# Altium schematic sheet 10_TYPE_C.SchDoc: C200
size 594 x 420 mm; Page Create Date: March  8, 1995; Page Number: 10; Page Size: A2; Comment: radxa_1010; Page Count: 21; RevCode: V1.11; Doc: 10_TYPE_C; DsnPath: D:\WMS\C200\CC122\对外\C200 V1.11.DSN; SchematicName: c200; PageName: 10_TYPE_C; PageSize: A2; TopSchematic: True
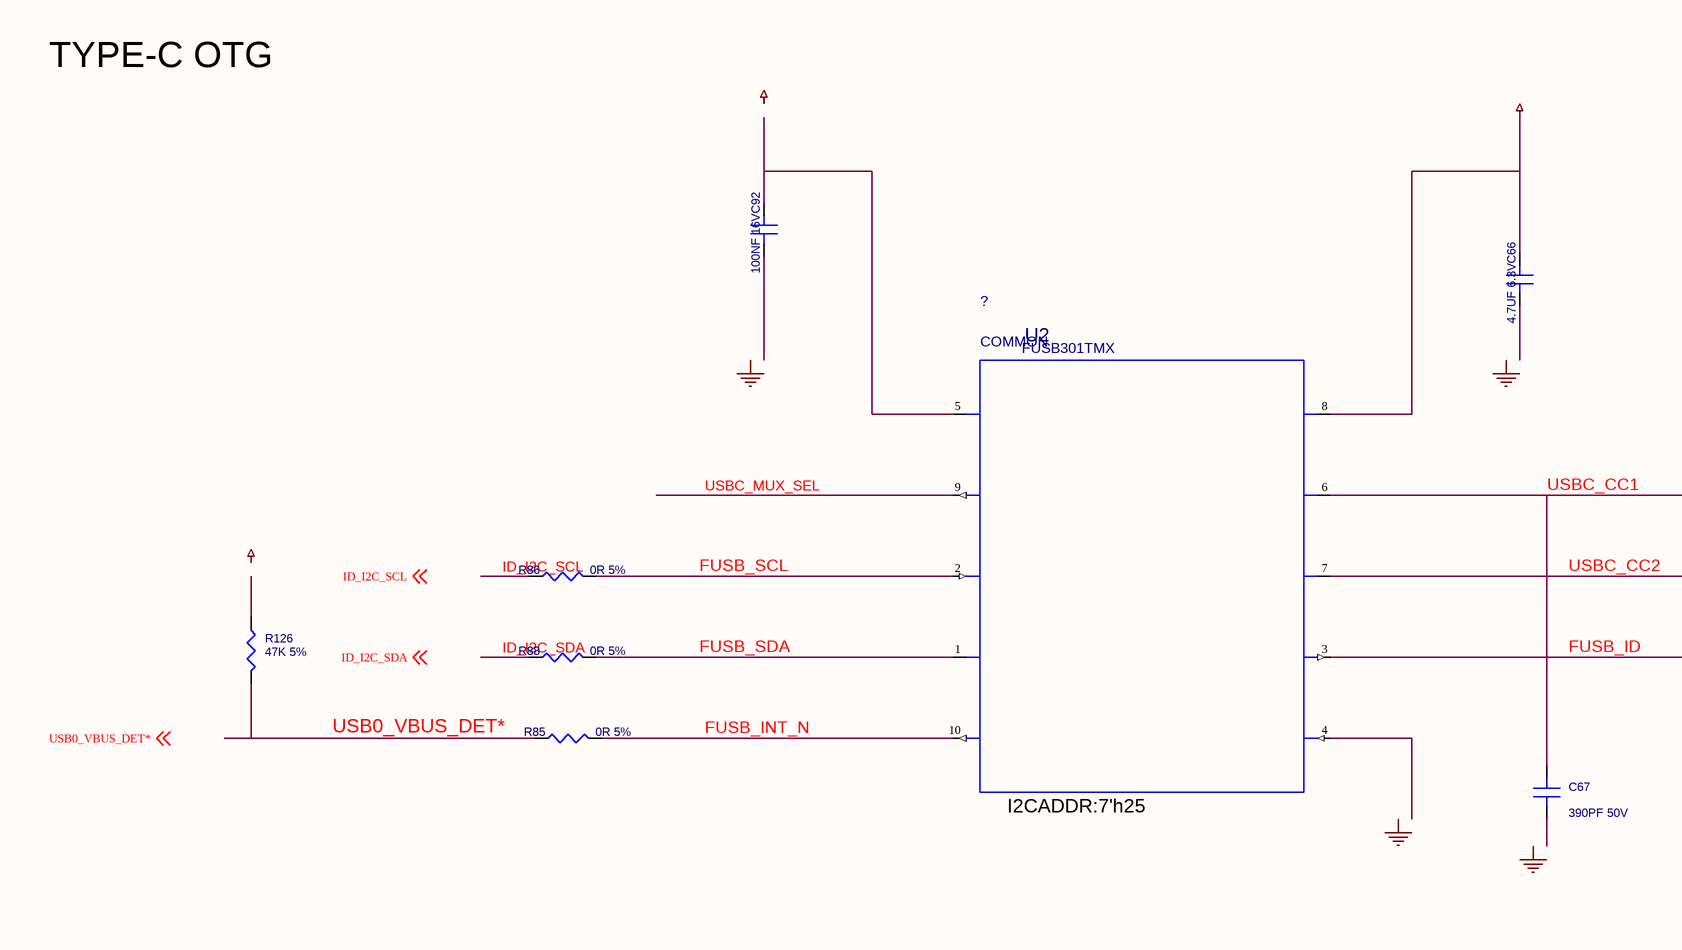
[diagram p0: 10_TYPE_C.SchDoc, top left]
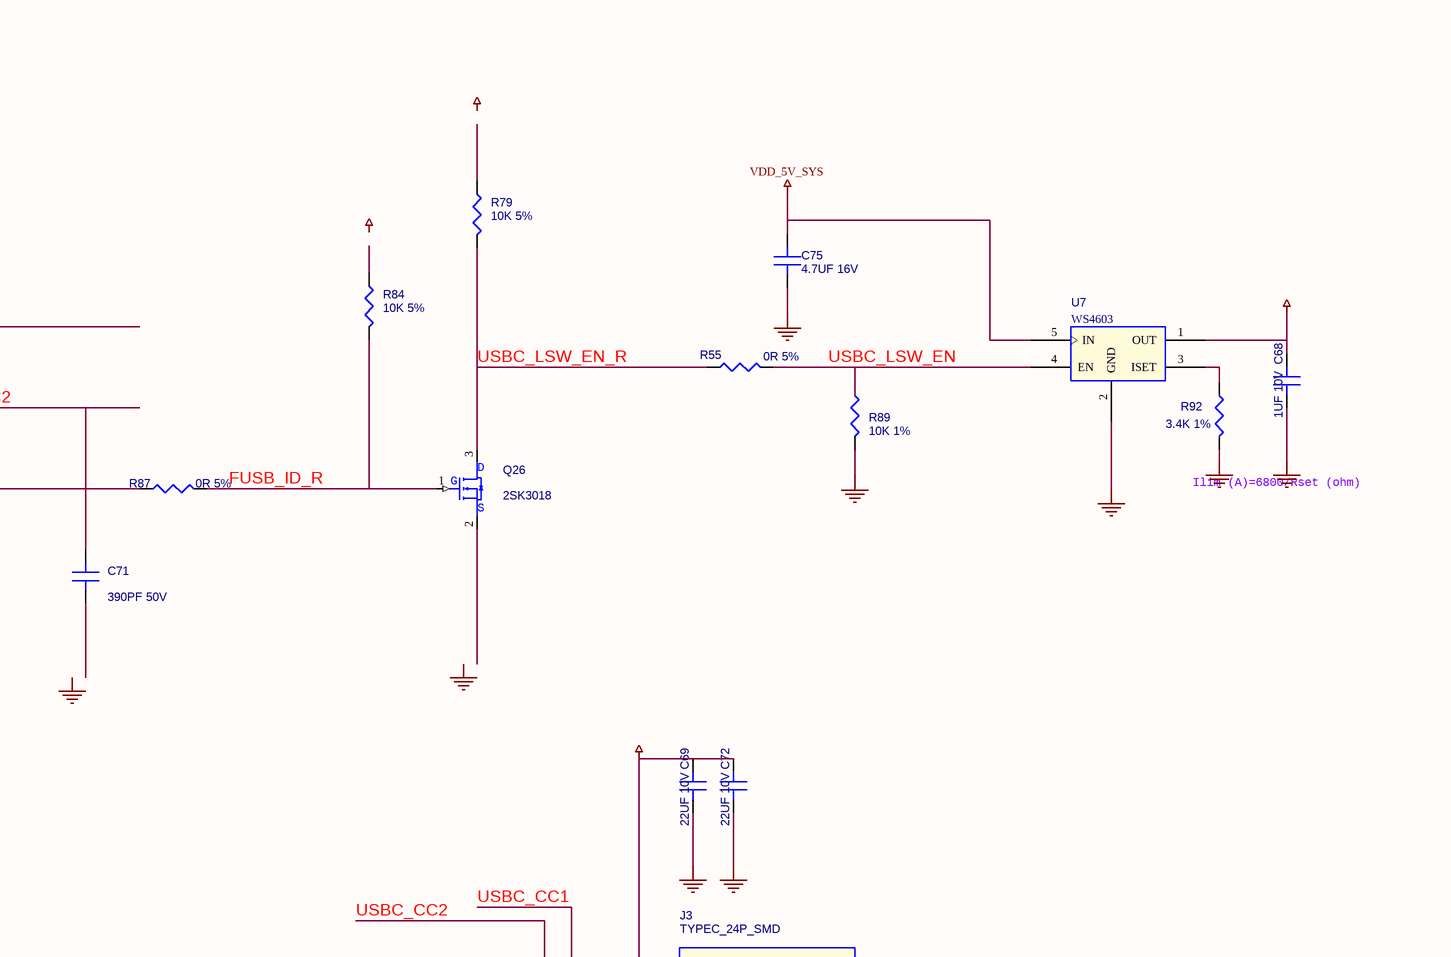
[diagram p1: 10_TYPE_C.SchDoc, top right]
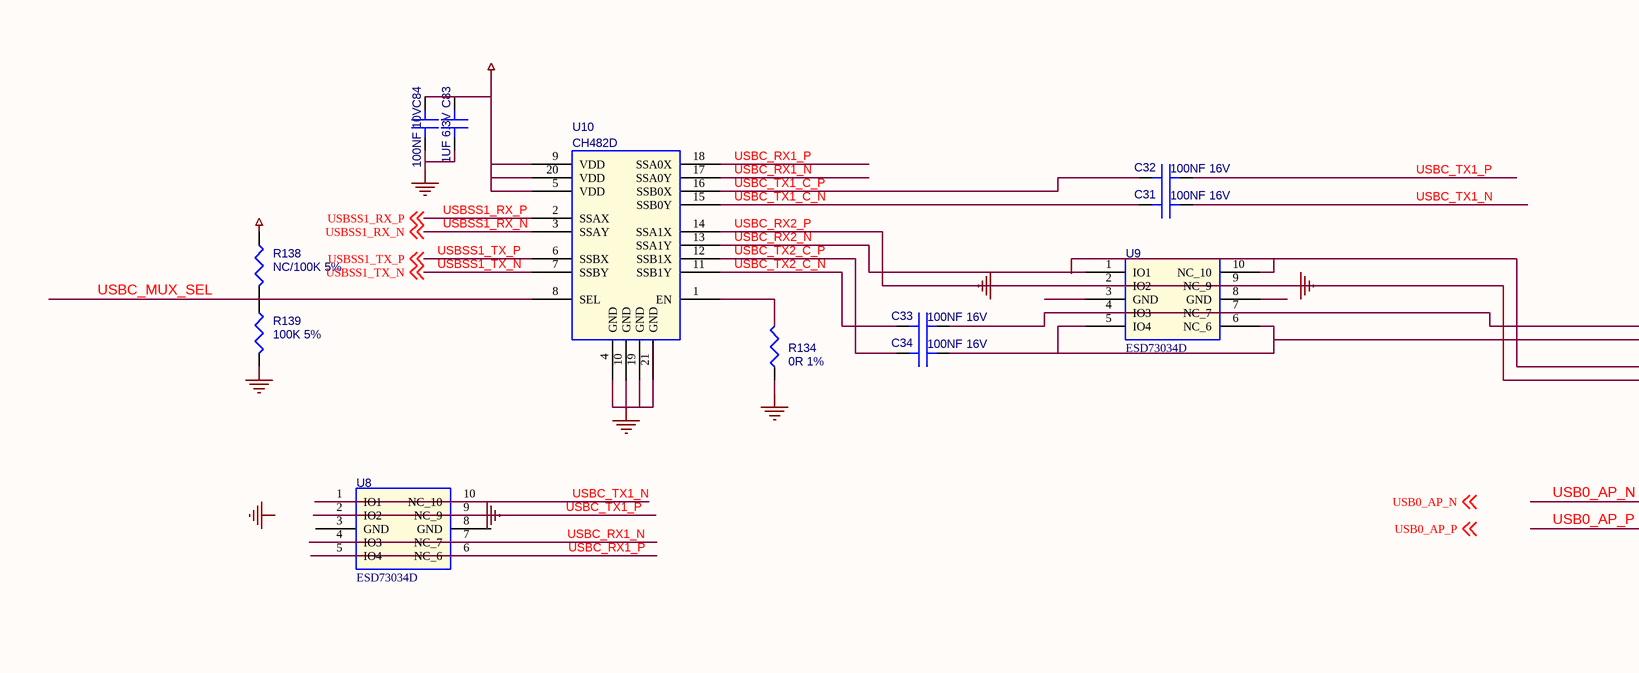
[diagram p2: 10_TYPE_C.SchDoc, bottom left]
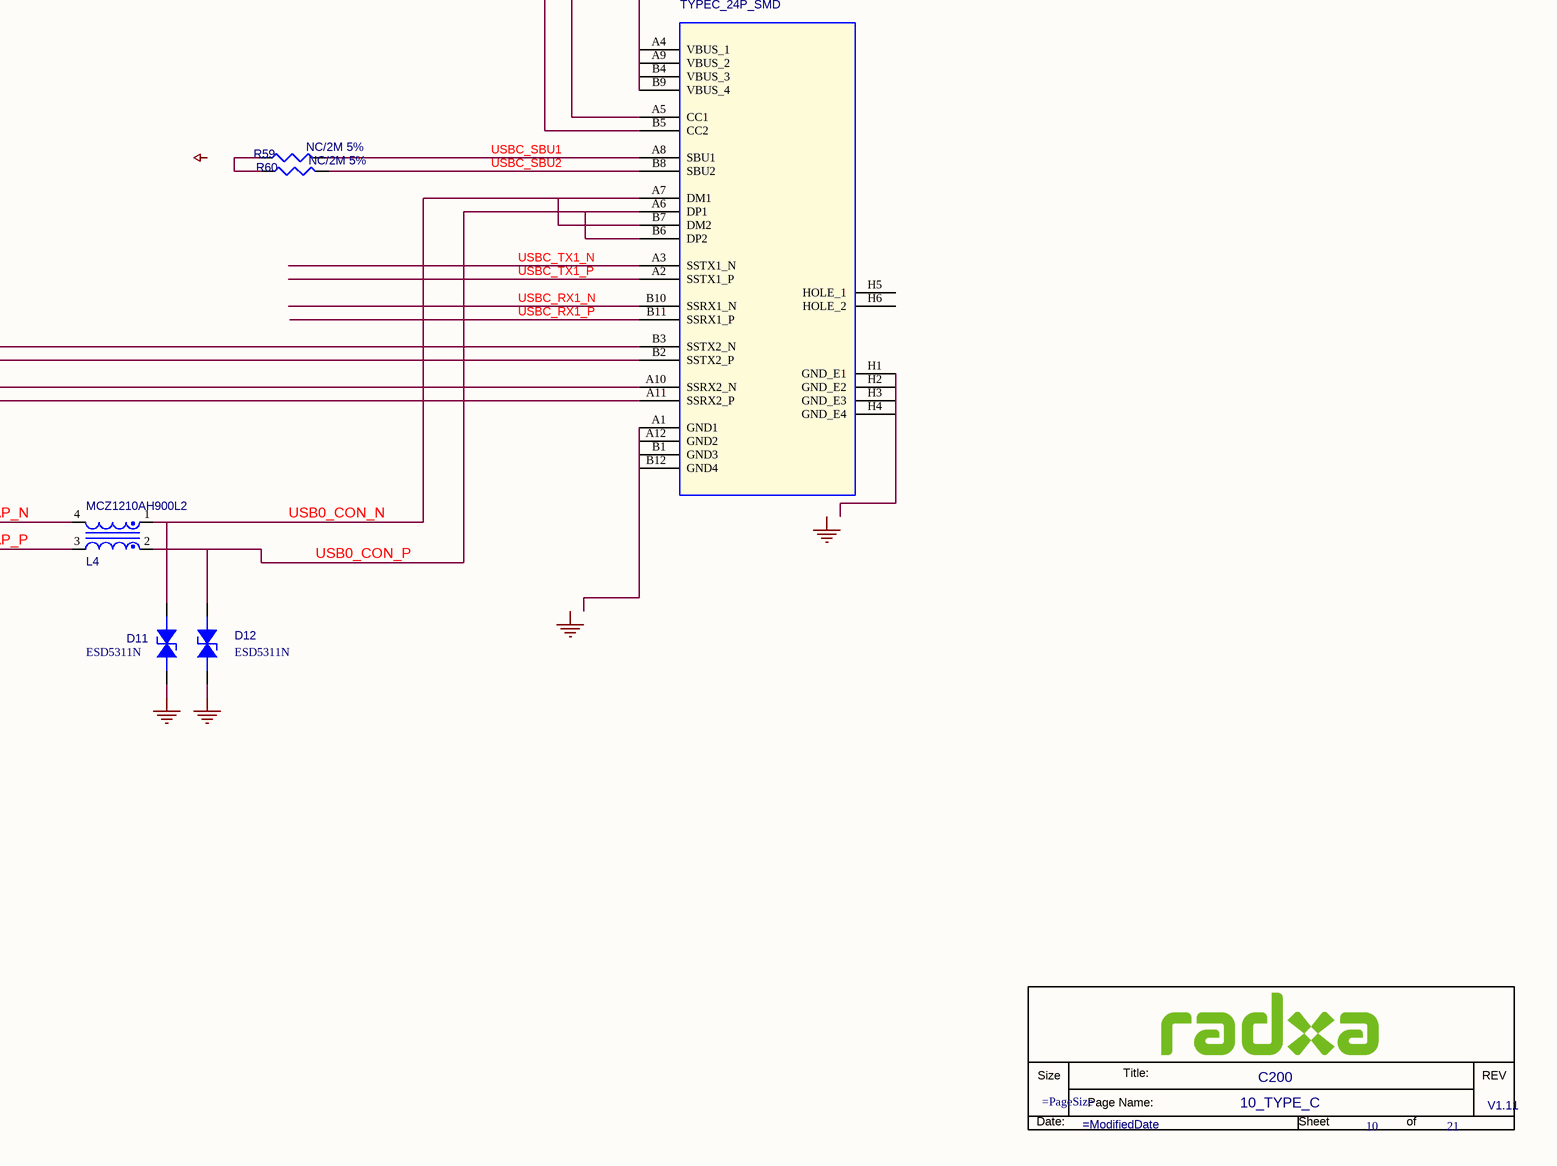
[diagram p3: 10_TYPE_C.SchDoc, bottom right]

## Parts
*  Doc: 10_TYPE_C  RevCode: V1.11  Title: C200  Page Number: 10  Page Count: 21  (hidden comment: radxa_1010)  (graphical)
C31  100NF 16V  [C0201]
C32  100NF 16V  [C0201]
C33  100NF 16V  [C0201]
C34  100NF 16V  [C0201]
C66  4.7UF 6.3V  [C0402]
C67  390PF 50V  [C0201]
C68  1UF 10V  [C0402]
C69  22UF 10V  [C0603]
C71  390PF 50V  [C0201]
C72  22UF 10V  [C0603]
C75  4.7UF 16V  [C0603]
C83  1UF 6.3V  [C0201]
C84  100NF 10V  [C0201]
C92  100NF 16V  [C0201]
D11  ESD5311N  [DFN1006-2L]
D12  ESD5311N  [DFN1006-2L]
J3  TYPEC_24P_SMD  [TYPEC_SM24_0D5_LIE]
L4  MCZ1210AH900L2  [LC1210]
Q26  2SK3018  [SOT_323]
R55  0R 5%  [R0402]
R59  NC/2M 5%  [R0402]
R60  NC/2M 5%  [R0402]
R79  10K 5%  [R0402]
R84  10K 5%  [R0402]
R85  0R 5%  [R0402]
R86  0R 5%  [R0402]
R87  0R 5%  [R0402]
R88  0R 5%  [R0402]
R89  10K 1%  [R0402]
R92  3.4K 1%  [R0402]
R126  47K 5%  [R0402]
R134  0R 1%  [R0402]
R138  NC/100K 5%  [R0402]
R139  100K 5%  [R0402]
U2  SKU: COMMON  [TMLP_0D4_1D2]  (hidden comment: U_USB_FUSB301)
U7  WS4603  [SOT23_5]
U8  ESD73034D  [XSON10_0D5_1D1X2D6]
U9  ESD73034D  [XSON10_0D5_1D1X2D6]
U10  CH482D  [QFN20_0D5_2D5]

## Nets
USBC_RX2_P: C32.2(B) C68.2(B) C69.2(B) C72.2(B) C75.2(B) C83.2(B) C84.2(B) D11.1(ANODE) D12.1(ANODE) J3.A2(SSTX1_P) J3.A11(SSRX2_P) R89.2 R92.1 R134.1 R139.2 U7.2(GND) U8.2(IO2) U8.9(NC_9) U9.2(IO2) U9.9(NC_9) U10.4(GND) U10.10(GND) U10.14(SSA1X) U10.19(GND) U10.21(GND)  [also labelled GND, USBC_TX1_P]
USBC_VBUS: C66.1(A) C68.1(A) C69.1(A) C72.1(A) J3.A4(VBUS_1) J3.A9(VBUS_2) J3.B4(VBUS_3) J3.B9(VBUS_4) U2.8(VBUS) U7.1(OUT)
VDD_3V3_SYS: C83.1(A) C84.1(A) R138.1 U10.5(VDD) U10.9(VDD) U10.20(VDD)
VDD_5V_SYS: C75.1(A) U7.5(IN)
FUSB_ID: R87.1 U2.3(ID)
FUSB_ID_R: Q26.1(G) R84.2 R87.2
FUSB_INT_N: R85.2 U2.10(INT_N)
FUSB_SCL: R86.2 U2.2(SCL)
FUSB_SDA: R88.2 U2.1(SDA)
ID_I2C_SCL: R86.1 ; off-sheet ID_I2C_SCL
ID_I2C_SDA: R88.1 ; off-sheet ID_I2C_SDA
USB0_AP_N: L4.4 ; off-sheet USB0_AP_N
USB0_AP_P: L4.3 ; off-sheet USB0_AP_P
USB0_CON_N: D11.2(CATHODE) J3.A7(DM1) J3.B7(DM2) L4.1
USB0_CON_P: D12.2(CATHODE) J3.A6(DP1) J3.B6(DP2) L4.2
USB0_VBUS_DET*: R85.1 R126.2 ; off-sheet USB0_VBUS_DET*
USBC_CC1: C67.1(A) J3.A5(CC1) U2.6(CC1)
USBC_CC2: C71.1(A) J3.B5(CC2) U2.7(CC2)
USBC_LSW_EN: R55.2 R89.1 U7.4(EN)
USBC_LSW_EN_R: Q26.3(D) R55.1 R79.2
USBC_MUX_SEL: R138.2 R139.1 U2.9(SS_SW) U10.8(SEL)
USBC_RX1_N: J3.B10(SSRX1_N) U8.4(IO3) U8.7(NC_7) U10.17(SSA0Y)
USBC_RX1_P: J3.B11(SSRX1_P) U8.5(IO4) U8.6(NC_6) U10.18(SSA0X)
USBC_RX2_N: J3.A10(SSRX2_N) U9.1(IO1) U9.10(NC_10) U10.13(SSA1Y)
USBC_SBU1: J3.A8(SBU1) R59.2
USBC_SBU2: J3.B8(SBU2) R60.2
USBC_TX1_C_N: C31.1(A) U10.15(SSB0Y)
USBC_TX1_C_P: C32.1(A) U10.16(SSB0X)
USBC_TX1_N: C31.2(B) J3.A3(SSTX1_N) U8.1(IO1) U8.10(NC_10)
USBC_TX2_C_N: C33.1(A) U10.11(SSB1Y)
USBC_TX2_C_P: C34.1(A) U10.12(SSB1X)
USBSS1_RX_N: U10.3(SSAY) ; off-sheet USBSS1_RX_N
USBSS1_RX_P: U10.2(SSAX) ; off-sheet USBSS1_RX_P
USBSS1_TX_N: U10.7(SSBY) ; off-sheet USBSS1_TX_N
USBSS1_TX_P: U10.6(SSBX) ; off-sheet USBSS1_TX_P
NetC33_2: C33.2(B) J3.B3(SSTX2_N) U9.4(IO3) U9.7(NC_7)
NetC34_2: C34.2(B) J3.B2(SSTX2_P) U9.5(IO4) U9.6(NC_6)
NetC92_1: C92.1(A) U2.5(VDD)
NetJ3_A1: J3.A1(GND1) J3.A12(GND2) J3.B1(GND3) J3.B12(GND4)
NetJ3_H1: J3.H1(GND_E1) J3.H2(GND_E2) J3.H3(GND_E3) J3.H4(GND_E4)
NetR59_1: R59.1 R60.1
NetR92_2: R92.2 U7.3(ISET)
NetR134_2: R134.2 U10.1(EN)

Not connected (* = marked no-connect by the designer): C66 2(B); C67 2(B); C71 2(B); C92 2(B); J3 H5(HOLE_1) H6(HOLE_2); Q26 2(S); R79 1; R84 1; R126 1; U2 4(GND); U8 3(GND) 8(GND); U9 3(GND) 8(GND)

## Notes on the sheet
- TYPE-C OTG
- (near R92) Ilim (A)=6800/Rset (ohm)
- I2CADDR:7'h25
- Labels drawn without touching a wire or pin: GND, ID_I2C_SCL, ID_I2C_SDA, USB0_AP_N, USB0_AP_P, USB0_VBUS_DET*, VDD_1V8, VDD_3V3_SYS
- (in symbol radxa_1010) Size; Title:; REV; Page Name:; Date:; Sheet; of

## Library data of the parts
C31 = C: SMD  0201  100NF  16V  X5R  ±20%  ROHS; PARTS: 1; Part Reference: C31; Part Number: A1C01.00099; OriginalSymbolOrigin: (0,30); PKG_TYPE: CAP2-100-250; LEVEL: STD; PINSWAP: (A,B); Value: 100NF 16V; Part Type: 陶瓷电容; PCB Footprint: C0201
C32 = C: SMD  0201  100NF  16V  X5R  ±20%  ROHS; PARTS: 1; Part Reference: C32; Part Number: A1C01.00099; OriginalSymbolOrigin: (0,30); PKG_TYPE: CAP2-100-250; LEVEL: STD; PINSWAP: (A,B); Value: 100NF 16V; Part Type: 陶瓷电容; PCB Footprint: C0201
C33 = C: SMD  0201  100NF  16V  X5R  ±20%  ROHS; PARTS: 1; Part Reference: C33; Part Number: A1C01.00099; OriginalSymbolOrigin: (0,30); PKG_TYPE: CAP2-100-250; LEVEL: STD; PINSWAP: (A,B); Value: 100NF 16V; Part Type: 陶瓷电容; PCB Footprint: C0201
C34 = C: SMD  0201  100NF  16V  X5R  ±20%  ROHS; PARTS: 1; Part Reference: C34; Part Number: A1C01.00099; OriginalSymbolOrigin: (0,30); PKG_TYPE: CAP2-100-250; LEVEL: STD; PINSWAP: (A,B); Value: 100NF 16V; Part Type: 陶瓷电容; PCB Footprint: C0201
C66 = C: SMD  0402  4.7UF  6.3V  X5R  ±20%  ROHS; PARTS: 1; Part Reference: C66; Part Number: A1C01.00007; OriginalSymbolOrigin: (0,30); PKG_TYPE: CAP2-100-250; LEVEL: STD; PINSWAP: (A,B); Value: 4.7UF 6.3V; Part Type: 陶瓷电容; PCB Footprint: C0402
C67 = C: SMD  0201  390PF  50V  X7R  ±10%  ROHS; PARTS: 1; Part Reference: C67; Part Number: A1C01.00134; OriginalSymbolOrigin: (0,30); PKG_TYPE: CAP2-100-250; LEVEL: STD; PINSWAP: (A,B); Value: 390PF 50V; Part Type: 陶瓷电容; PCB Footprint: C0201
C68 = C: SMD  0402  1UF  10V  X5R  ±20%  ROHS; PARTS: 1; Part Reference: C68; Part Number: A1C01.00148; OriginalSymbolOrigin: (0,30); PKG_TYPE: CAP2-100-250; LEVEL: STD; PINSWAP: (A,B); Value: 1UF 10V; Part Type: 陶瓷电容; PCB Footprint: C0402
C69 = C: SMD  0603  22UF  10V  X5R  ±20%  ROHS; PARTS: 1; Part Reference: C69; Part Number: A1C01.00015; OriginalSymbolOrigin: (0,30); PKG_TYPE: CAP2-100-250; LEVEL: STD; PINSWAP: (A,B); Value: 22UF 10V; Part Type: 陶瓷电容; PCB Footprint: C0603
C71 = C: SMD  0201  390PF  50V  X7R  ±10%  ROHS; PARTS: 1; Part Reference: C71; Part Number: A1C01.00134; OriginalSymbolOrigin: (0,30); PKG_TYPE: CAP2-100-250; LEVEL: STD; PINSWAP: (A,B); Value: 390PF 50V; Part Type: 陶瓷电容; PCB Footprint: C0201
C72 = C: SMD  0603  22UF  10V  X5R  ±20%  ROHS; PARTS: 1; Part Reference: C72; Part Number: A1C01.00015; OriginalSymbolOrigin: (0,30); PKG_TYPE: CAP2-100-250; LEVEL: STD; PINSWAP: (A,B); Value: 22UF 10V; Part Type: 陶瓷电容; PCB Footprint: C0603
C75 = C: SMD  0603  4.7UF  16V  X5R  ±10%  ROHS; PARTS: 1; Part Reference: C75; Part Number: A1C01.00239; OriginalSymbolOrigin: (0,30); PKG_TYPE: CAP2-100-250; LEVEL: STD; PINSWAP: (A,B); Value: 4.7UF 16V; Part Type: 陶瓷电容; PCB Footprint: C0603
C83 = C: SMD  0201  1UF  6.3V  X5R  ±20%  ROHS; PARTS: 1; Part Reference: C83; Part Number: A1C01.00083; OriginalSymbolOrigin: (0,30); PKG_TYPE: CAP2-100-250; LEVEL: STD; PINSWAP: (A,B); Value: 1UF 6.3V; Part Type: 陶瓷电容; PCB Footprint: C0201
C84 = C: SMD  0201  100NF  10V  X5R  ±10%  ROHS; PARTS: 1; Part Reference: C84; Part Number: A1C01.00097; OriginalSymbolOrigin: (0,30); PKG_TYPE: CAP2-100-250; LEVEL: STD; PINSWAP: (A,B); Value: 100NF 10V; Part Type: 陶瓷电容; PCB Footprint: C0201
C92 = C: SMD  0201  100NF  16V  X5R  ±10%  ROHS; PARTS: 1; Part Reference: C92; Part Number: A1C01.00018; OriginalSymbolOrigin: (0,30); PKG_TYPE: CAP2-100-250; LEVEL: STD; PINSWAP: (A,B); Value: 100NF 16V; Part Type: 陶瓷电容; PCB Footprint: C0201
D11 = ESD: SMD  编带  DFN1006-2L  ESD5311N-2/TR  双向TVS  VRWM=5V  0.25pF  84W  WILLSEMI(韦尔)  ROHS; Part Reference: D11; Part Number: A1D02.00001; Parameter: ESD-台舟 ESD5341N-封装 esd0402; ID: DE-E0004; Value: ESD5311N; Part Type: 二极管-ESD管-桥堆-TVS管; PCB Footprint: DFN1006-2L
D12 = ESD: SMD  编带  DFN1006-2L  ESD5311N-2/TR  双向TVS  VRWM=5V  0.25pF  84W  WILLSEMI(韦尔)  ROHS; Part Reference: D12; Part Number: A1D02.00001; Parameter: ESD-台舟 ESD5341N-封装 esd0402; ID: DE-E0004; Value: ESD5311N; Part Type: 二极管-ESD管-桥堆-TVS管; PCB Footprint: DFN1006-2L
J3 = TYPEC_24P_SMD: Part Reference: J3; PCB Footprint: TYPEC_SM24_0D5_LIE; Value: TYPEC_24P_SMD
L4 = MCZ1210AH900L2: SMD  MCZ1210AH900L2TA0G  90R  4PIN  TDK  ROHS; Part Reference: L4; Part Number: A1L03.00007; PCB Footprint: LC1210; Value: MCZ1210AH900L2; Part Type: 共模电感
Q26 = MOSFET_NPN: SMD  编带  SOT-323  2SK3018  N沟道  长晶  ROHS; Part Reference: Q26; Part Number: A1D01.00007; Temp Coeff: -55℃ to ＋150℃; Value: 2SK3018; Part Type: 三极管-MOS管; PCB Footprint: SOT_323
R55 = R: SMD  0201  0R  1/20W  ±5%  ROHS; Part Reference: R55; Part Number: A1R01.00027; PCB Footprint: R0201; Temp Coeff: －55℃ ~ ＋125℃; Value: 0R 5%; Part Type: 贴片电阻
R59 = R: SMD  0201  2M  1/20W  ±5%  ROHS; Part Reference: R59; Part Number: A1R01.00114; PCB Footprint: R0201; Value: NC/2M 5%; Part Type: 贴片电阻
R60 = R: SMD  0201  2M  1/20W  ±5%  ROHS; Part Reference: R60; Part Number: A1R01.00114; PCB Footprint: R0201; Value: NC/2M 5%; Part Type: 贴片电阻
R79 = R: SMD  0201  10K  1/20W  ±5%  ROHS; Part Reference: R79; Part Number: A1R01.00012; PCB Footprint: R0201; Temp Coeff: －55℃ ~ ＋125℃; Value: 10K 5%; Part Type: 贴片电阻
R84 = R: SMD  0201  10K  1/20W  ±5%  ROHS; Part Reference: R84; Part Number: A1R01.00012; PCB Footprint: R0201; Temp Coeff: －55℃ ~ ＋125℃; Value: 10K 5%; Part Type: 贴片电阻
R85 = R: SMD  0201  0R  1/20W  ±5%  ROHS; Part Reference: R85; Part Number: A1R01.00027; PCB Footprint: R0201; Temp Coeff: －55℃ ~ ＋125℃; Value: 0R 5%; Part Type: 贴片电阻
R86 = R: SMD  0201  0R  1/20W  ±5%  ROHS; Part Reference: R86; Part Number: A1R01.00027; PCB Footprint: R0201; Temp Coeff: －55℃ ~ ＋125℃; Value: 0R 5%; Part Type: 贴片电阻
R87 = R: SMD  0201  0R  1/20W  ±5%  ROHS; Part Reference: R87; Part Number: A1R01.00027; PCB Footprint: R0201; Temp Coeff: －55℃ ~ ＋125℃; Value: 0R 5%; Part Type: 贴片电阻
R88 = R: SMD  0201  0R  1/20W  ±5%  ROHS; Part Reference: R88; Part Number: A1R01.00027; PCB Footprint: R0201; Temp Coeff: －55℃ ~ ＋125℃; Value: 0R 5%; Part Type: 贴片电阻
R89 = R: SMD  0402  10K  1/16W  ±1%  ROHS; Part Reference: R89; CDS_PHYS_PART_NAME: R_0402-10K,5 %,62.5MW,195-0486-000-10K,195-0486-000; CDS_PART_NAME: R_0402-10K,5 %,62.5MW,195-0486-000; Part Number: A1R01.00222; SEC: 1; XY: (-7750,6150); VER: 2; TOL: 5%; SIGNAL_MODEL: nv_res; ROT: 0; PHYS_PAGE: 14; PATH: I42; PACK_TYPE: 402; NV_PN: 195-0486-000; MAX_WATTAGE: 62.5mW; DRAWING: #NAME?; DEVICE_TYPENAME: R_0402-10K5625MW195-0486-000-10K195-0486-000; CDS_LIB: discrete; ASSEMBLY: USB3_TYPEA; PCB Footprint: R0402; Value: 10K 1%; CHIPS_PART_NAME: R; CDS_SEC: 1; Part Type: 贴片电阻
R92 = R: SMD  0402  3.4K  1/16W  ±1%  ROHS; Part Reference: R92; Part Number: A1R01.00506; PCB Footprint: R0402; Value: 3.4K 1%; Part Type: 贴片电阻
R126 = R: SMD  0402  47K  1/16W  ±5%  ROHS; Part Reference: R126; Part Number: A1R01.00053; Temp Coeff: －55℃ ~ ＋155℃; PCB Footprint: R0402; Value: 47K 5%; Part Type: 贴片电阻
R134 = R: SMD  0402  0R  1/16W  ±1%  ROHS; Part Reference: R134; CDS_PHYS_PART_NAME: R_0402-10K,5 %,62.5MW,195-0486-000-10K,195-0486-000; CDS_PART_NAME: R_0402-10K,5 %,62.5MW,195-0486-000; Part Number: A1R01.00219; SEC: 1; XY: (-10850,1350); VER: 2; TOL: 5%; SIGNAL_MODEL: nv_res; ROT: 0; PHYS_PAGE: 18; PATH: I92; PACK_TYPE: 402; NV_PN: 195-0486-000; MAX_WATTAGE: 62.5mW; DRAWING: @P3449_B01_LIB.P3449_B01(SCH_1):PAGE18; DEVICE_TYPENAME: R_0402-10K5625MW195-0486-000-10K195-0486-000; CDS_LIB: discrete; ASSEMBLY: CAM; PCB Footprint: R0402; Value: 0R 1%; CHIPS_PART_NAME: R; CDS_SEC: 1; Part Type: 贴片电阻
R138 = R: SMD  0201  100K  1/20W  ±5%  ROHS; Part Reference: R138; Part Number: A1R01.00006; PCB Footprint: R0201; Value: NC/100K 5%; Part Type: 贴片电阻
R139 = R: SMD  0201  100K  1/20W  ±5%  ROHS; Part Reference: R139; Part Number: A1R01.00006; PCB Footprint: R0201; Value: 100K 5%; Part Type: 贴片电阻
U2 = FUSB301TMX: Part Reference: U2; OriginalSymbolOrigin: (-325,400); ASSEMBLY: ?; NV_NAME: ?; NV_PN: ?; PACK_TYPE: FUSB301TMX; PATH: ?; PLACEMENT_NOTE: ?; TYPE: ?; Value: U_USB_FUSB301; PCB Footprint: TMLP_0D4_1D2
U7 = WS4603: SMD  功率开关  WS4603E-5/TR  1.25H  SOT-23-5L  ROHS; Part Reference: U7; Part Number: A1I01.00241; Parameter: SOT23-5; ID: U-IC0020; Temp Coeff: -40℃ to 85℃; Value: WS4603; Part Type: 集成电路/模块; PCB Footprint: SOT23_5
U8 = ESD73034D: SMD  编带  SON10  ESD73034D-10/TR  4Line 双向TVS  VRWM=3.3V  0.2pF  33W  WILLSEMI(韦尔)  ROHS; Part Reference: U8; Part Number: A1D02.00015; Parameter: ESD-ESD73034D-封装 SON10_2R50X1R00X0R50; PCB Footprint: XSON10_0D5_1D1X2D6; Value: ESD73034D; Part Type: 二极管-ESD管-桥堆-TVS管
U9 = ESD73034D: SMD  编带  SON10  ESD73034D-10/TR  4Line 双向TVS  VRWM=3.3V  0.2pF  33W  WILLSEMI(韦尔)  ROHS; Part Reference: U9; Part Number: A1D02.00015; Parameter: ESD-ESD73034D-封装 SON10_2R50X1R00X0R50; PCB Footprint: XSON10_0D5_1D1X2D6; Value: ESD73034D; Part Type: 二极管-ESD管-桥堆-TVS管
U10 = CH482D: SMD  USB3.0  CH482D  QFN20  沁恒  ROHS; Part Reference: U10; Part Number: A1I01.00036; Value: CH482D; Part Type: 集成电路/模块; PCB Footprint: QFN20_0D5_2D5
* = radxa_1010: Page Create Date: March  8, 1995; Page Size: =PageSize; Page Modify Date: =ModifiedDate